# Altium project hotfire_teststand.PrjPcb
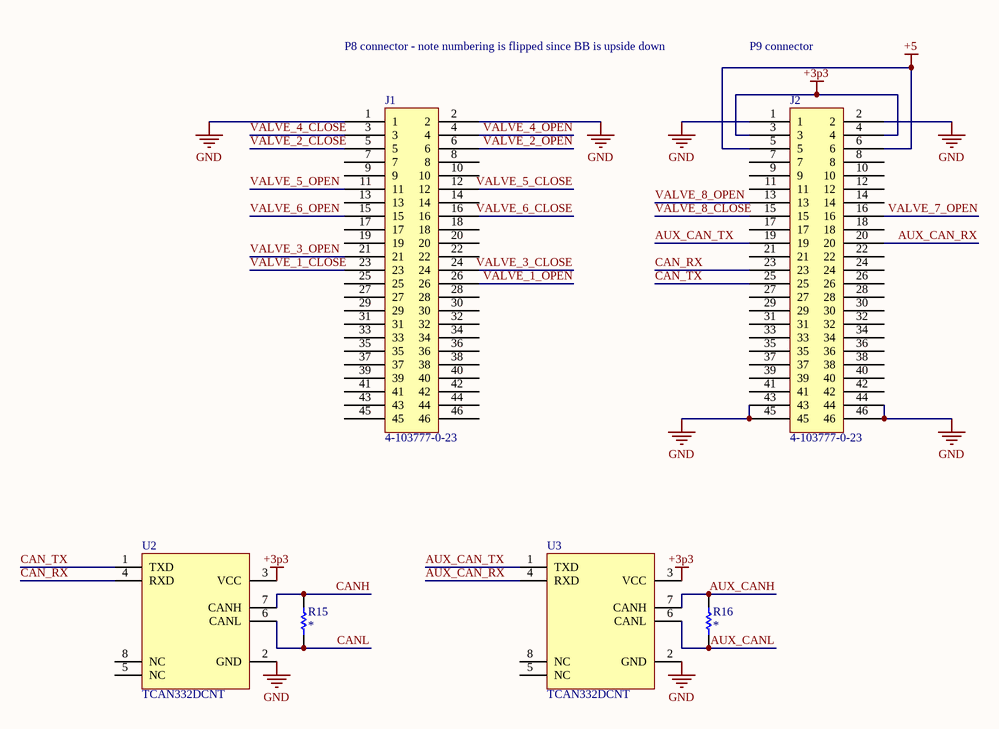
[diagram p0: beaglebone.SchDoc]
5 sheets, 80 parts. Net scope: hierarchical (ports join the sheet entries above them; power ports are global).
Sheets:
  beaglebone.SchDoc
  power.SchDoc
  valveconn.SchDoc
    DRV1 = valve.SchDoc
    DRV2 = valve.SchDoc
    DRV3 = valve.SchDoc
  ignition.SchDoc

## Sheet beaglebone.SchDoc: Monolith Beaglebone Connectors
size A; SheetNumber: 1; SheetTotal: 5

### Parts
J1  4-103777-0-23
J2  4-103777-0-23
R15  *  [R0603]
R16  *  [R0603]
U2  TCAN332DCNT  [SOT-23-8]
U3  TCAN332DCNT  [SOT-23-8]

### Nets
+3p3: J2.3 J2.4 U2.3(VCC) U3.3(VCC)
+5: J2.5 J2.6
GND: J1.1 J1.2 J2.1 J2.2 J2.43 J2.44 J2.45 J2.46 U2.2(GND) U3.2(GND)
AUX_CAN_RX: J2.20 U3.4(RXD)
AUX_CAN_TX: J2.19 U3.1(TXD)
AUX_CANH: R16.1 U3.7(CANH)
AUX_CANL: R16.2 U3.6(CANL)
CAN_RX: J2.23 U2.4(RXD)
CAN_TX: J2.25 U2.1(TXD)
CANH: R15.1 U2.7(CANH)
CANL: R15.2 U2.6(CANL)
VALVE_1_CLOSE: J1.23
VALVE_1_OPEN: J1.26
VALVE_2_CLOSE: J1.5
VALVE_2_OPEN: J1.6
VALVE_3_CLOSE: J1.24
VALVE_3_OPEN: J1.21
VALVE_4_CLOSE: J1.3
VALVE_4_OPEN: J1.4
VALVE_5_CLOSE: J1.12
VALVE_5_OPEN: J1.11
VALVE_6_CLOSE: J1.16
VALVE_6_OPEN: J1.15
VALVE_7_OPEN: J2.16
VALVE_8_CLOSE: J2.15
VALVE_8_OPEN: J2.13

Not connected (* = marked no-connect by the designer): J1 7 8 9 10 13 14 17 18 19 20 22 25 27 28 29 30 31 32 33 34 35 36 37 38 39 40 41 42 43 44 45 46; J2 7 8 9 10 11 12 14 17 18 21 22 24 26 27 28 29 30 31 32 33 34 35 36 37 38 39 40 41 42; U2 5(NC) 8(NC); U3 5(NC) 8(NC)

### Notes on the sheet
- P8 connector - note numbering is flipped since BB is upside down
- P9 connector

### Library data of the parts
R15 R16 = R0603: RESISTOR 0603; Value: *
U2 U3 = TCAN332DCNT: IC TXRX CAN 3.3V SOT23-8

## Sheet power.SchDoc: Monolith Power
size A; SheetNumber: 2; SheetTotal: 5
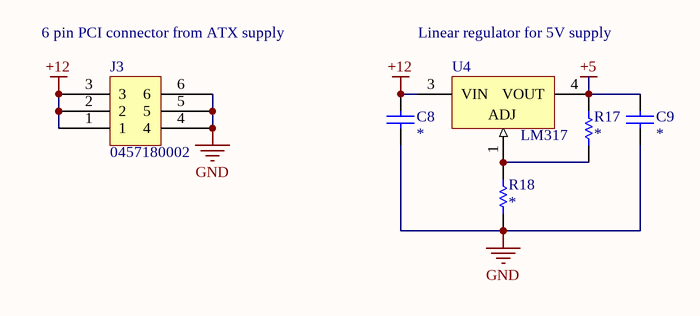
[diagram p1: power.SchDoc]

### Parts
C8  *  [C0603]
C9  *  [C0805]
J3  0457180002
R17  *  [R0603]
R18  *  [R0603]
U4  LM317  [D-PAK]

### Nets
+5: C9.1 R17.1 U4.4(VOUT)
+12: C8.1 J3.1 J3.2 J3.3 U4.3(VIN)
GND: C8.2 C9.2 J3.4 J3.5 J3.6 R18.2
NetR17_2: R17.2 R18.1 U4.1(ADJ)

### Notes on the sheet
- (near J3) 6 pin PCI connector from ATX supply
- Linear regulator for 5V supply

### Library data of the parts
C8 = C0603: 0603 Capacitor; Value: *
C9 = C0805: 0805 Capacitor; Value: *
R17 R18 = R0603: RESISTOR 0603; Value: *
U4 = LM317: Linear Voltage Regulator

## Sheet valveconn.SchDoc
size A; SheetNumber: 3; SheetTotal: 5
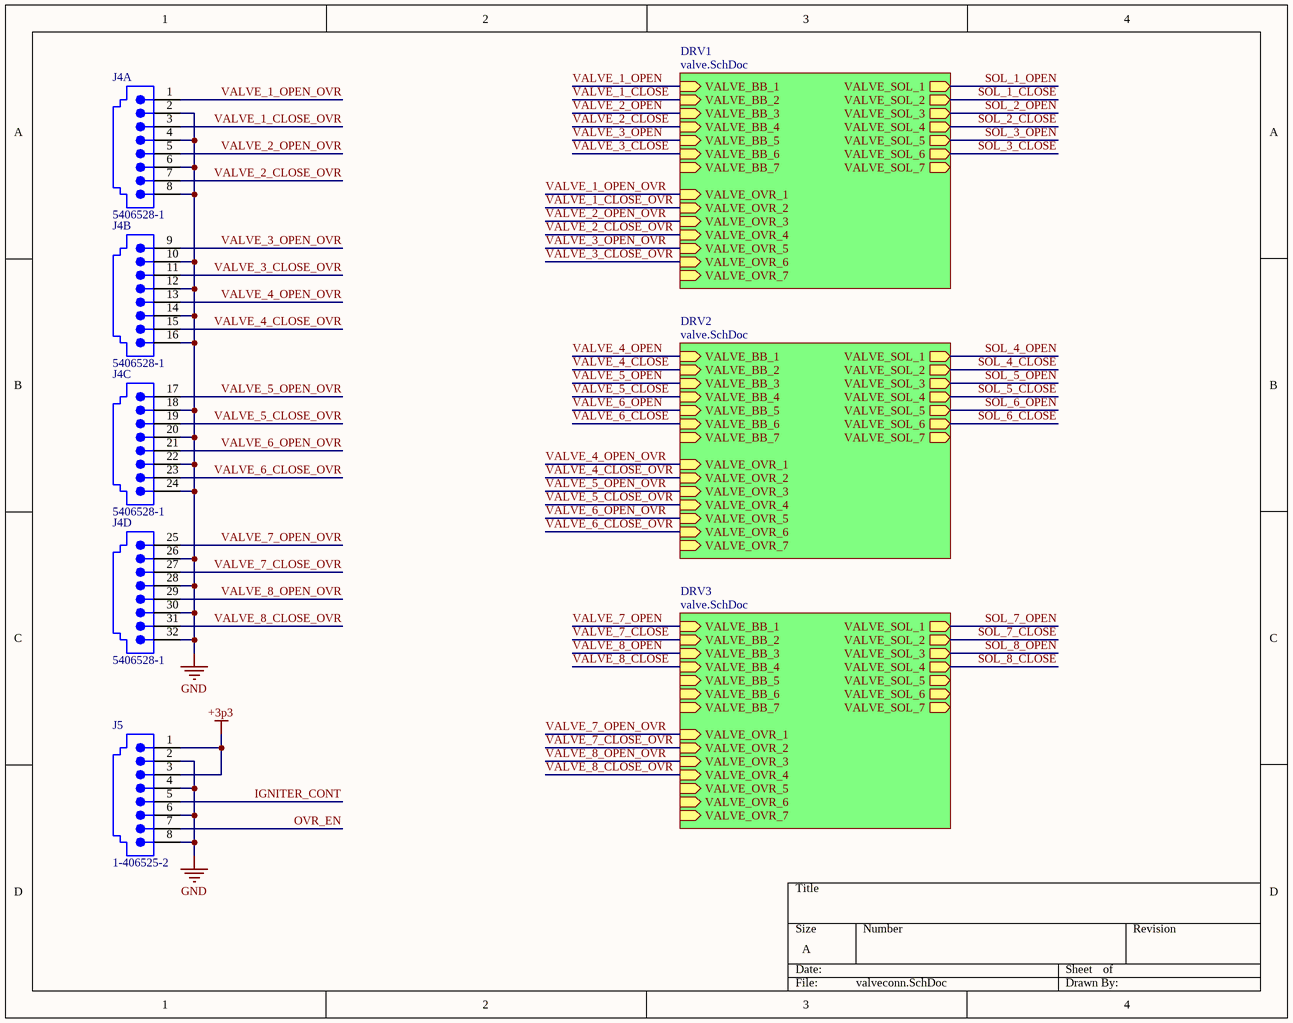
[diagram p2: valveconn.SchDoc]

### Parts
J4  5406528-1  [5406528-1]  (parts A,B,C,D of 4)
J5  1-406525-2  [1-406525-2]

### Sub-sheets
DRV1 = valve.SchDoc: VALVE_BB_7 (in), VALVE_OVR_4 (in), VALVE_BB_1 (in), VALVE_OVR_7 (in), VALVE_SOL_2 (out), VALVE_SOL_7 (out), VALVE_SOL_3 (out), VALVE_OVR_1 (in), VALVE_SOL_1 (out), VALVE_OVR_6 (in), VALVE_SOL_5 (out), VALVE_BB_2 (in), VALVE_BB_3 (in), VALVE_OVR_3 (in), VALVE_BB_4 (in), VALVE_OVR_5 (in), VALVE_SOL_4 (out), VALVE_BB_5 (in), VALVE_BB_6 (in), VALVE_SOL_6 (out), VALVE_OVR_2 (in)
DRV2 = valve.SchDoc: VALVE_BB_7 (in), VALVE_OVR_4 (in), VALVE_BB_1 (in), VALVE_OVR_7 (in), VALVE_SOL_2 (out), VALVE_SOL_7 (out), VALVE_SOL_3 (out), VALVE_OVR_1 (in), VALVE_SOL_1 (out), VALVE_OVR_6 (in), VALVE_SOL_5 (out), VALVE_BB_2 (in), VALVE_BB_3 (in), VALVE_OVR_3 (in), VALVE_BB_4 (in), VALVE_OVR_5 (in), VALVE_SOL_4 (out), VALVE_BB_5 (in), VALVE_BB_6 (in), VALVE_SOL_6 (out), VALVE_OVR_2 (in)
DRV3 = valve.SchDoc: VALVE_BB_7 (in), VALVE_OVR_4 (in), VALVE_BB_1 (in), VALVE_OVR_7 (in), VALVE_SOL_2 (out), VALVE_SOL_7 (out), VALVE_SOL_3 (out), VALVE_OVR_1 (in), VALVE_SOL_1 (out), VALVE_OVR_6 (in), VALVE_SOL_5 (out), VALVE_BB_2 (in), VALVE_BB_3 (in), VALVE_OVR_3 (in), VALVE_BB_4 (in), VALVE_OVR_5 (in), VALVE_SOL_4 (out), VALVE_BB_5 (in), VALVE_BB_6 (in), VALVE_SOL_6 (out), VALVE_OVR_2 (in)

### Nets
+3p3: J5.1 J5.3
GND: J4.2 J4.4 J4.6 J4.8 J4.10 J4.12 J4.14 J4.16 J4.18 J4.20 J4.22 J4.24 J4.26 J4.28 J4.30 J4.32 J5.2 J5.4 J5.6 J5.8
IGNITER_CONT: J5.5
OVR_EN: J5.7
VALVE_1_CLOSE_OVR: J4.3 ; sheet DRV1/VALVE_OVR_2
VALVE_1_OPEN_OVR: J4.1 ; sheet DRV1/VALVE_OVR_1
VALVE_2_CLOSE_OVR: J4.7 ; sheet DRV1/VALVE_OVR_4
VALVE_2_OPEN_OVR: J4.5 ; sheet DRV1/VALVE_OVR_3
VALVE_3_CLOSE_OVR: J4.11 ; sheet DRV1/VALVE_OVR_6
VALVE_3_OPEN_OVR: J4.9 ; sheet DRV1/VALVE_OVR_5
VALVE_4_CLOSE_OVR: J4.15 ; sheet DRV2/VALVE_OVR_2
VALVE_4_OPEN_OVR: J4.13 ; sheet DRV2/VALVE_OVR_1
VALVE_5_CLOSE_OVR: J4.19 ; sheet DRV2/VALVE_OVR_4
VALVE_5_OPEN_OVR: J4.17 ; sheet DRV2/VALVE_OVR_3
VALVE_6_CLOSE_OVR: J4.23 ; sheet DRV2/VALVE_OVR_6
VALVE_6_OPEN_OVR: J4.21 ; sheet DRV2/VALVE_OVR_5
VALVE_7_CLOSE_OVR: J4.27 ; sheet DRV3/VALVE_OVR_2
VALVE_7_OPEN_OVR: J4.25 ; sheet DRV3/VALVE_OVR_1
VALVE_8_CLOSE_OVR: J4.31 ; sheet DRV3/VALVE_OVR_4
VALVE_8_OPEN_OVR: J4.29 ; sheet DRV3/VALVE_OVR_3

### Library data of the parts
J4 = 5406528-1: 4 port RJ45
J5 = 1-406525-2: 1 port RJ45

## Sheet valve.SchDoc: Monolith Valve Drivers
size A; SheetNumber: 4; SheetTotal: 5; R_OVR: 10k
Used 3 times, as channels DRV1, DRV2, DRV3. Parts and nets are listed once, with the designators drawn on the sheet.
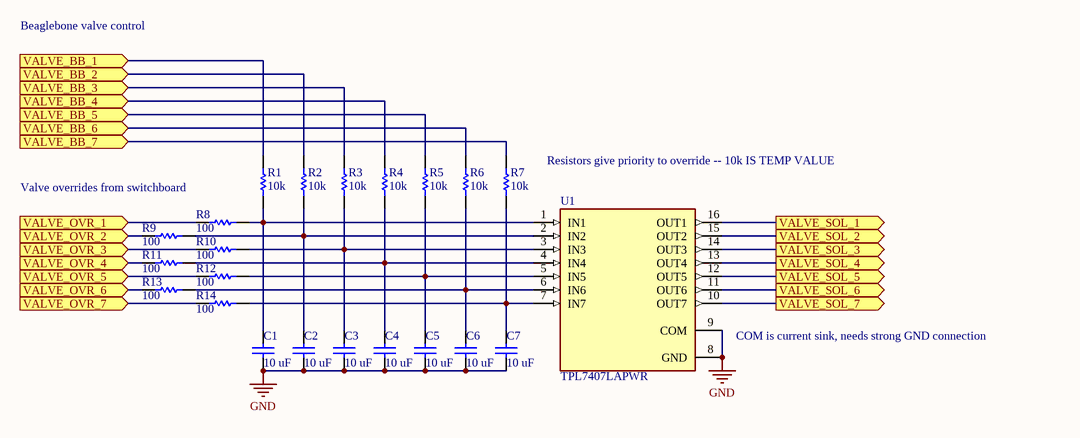
[diagram p3: valve.SchDoc]

### Parts
C1  10 uF  [C0805]
C2  10 uF  [C0805]
C3  10 uF  [C0805]
C4  10 uF  [C0805]
C5  10 uF  [C0805]
C6  10 uF  [C0805]
C7  10 uF  [C0805]
R1  10k  [R0603]
R2  10k  [R0603]
R3  10k  [R0603]
R4  10k  [R0603]
R5  10k  [R0603]
R6  10k  [R0603]
R7  10k  [R0603]
R8  100  [R0603]
R9  100  [R0603]
R10  100  [R0603]
R11  100  [R0603]
R12  100  [R0603]
R13  100  [R0603]
R14  100  [R0603]
U1  TPL7407LAPWR  [FP-PW0016A-IPC_A]

### Ports
VALVE_BB_1 (in), VALVE_BB_2 (in), VALVE_BB_3 (in), VALVE_BB_4 (in), VALVE_BB_5 (in), VALVE_BB_6 (in), VALVE_BB_7 (in), VALVE_OVR_1 (in), VALVE_OVR_2 (in), VALVE_OVR_3 (in), VALVE_OVR_4 (in), VALVE_OVR_5 (in), VALVE_OVR_6 (in), VALVE_OVR_7 (in), VALVE_SOL_1 (out), VALVE_SOL_2 (out), VALVE_SOL_3 (out), VALVE_SOL_4 (out), VALVE_SOL_5 (out), VALVE_SOL_6 (out), VALVE_SOL_7 (out)

### Nets
GND: C1.2 C2.2 C3.2 C4.2 C5.2 C6.2 C7.2 U1.8(GND) U1.9(COM)
VALVE_BB_1: R1.1 ; port VALVE_BB_1
VALVE_BB_2: R2.1 ; port VALVE_BB_2
VALVE_BB_3: R3.1 ; port VALVE_BB_3
VALVE_BB_4: R4.1 ; port VALVE_BB_4
VALVE_BB_5: R5.1 ; port VALVE_BB_5
VALVE_BB_6: R6.1 ; port VALVE_BB_6
VALVE_BB_7: R7.1 ; port VALVE_BB_7
VALVE_OVR_1: R8.2 ; port VALVE_OVR_1
VALVE_OVR_2: R9.2 ; port VALVE_OVR_2
VALVE_OVR_3: R10.2 ; port VALVE_OVR_3
VALVE_OVR_4: R11.2 ; port VALVE_OVR_4
VALVE_OVR_5: R12.2 ; port VALVE_OVR_5
VALVE_OVR_6: R13.2 ; port VALVE_OVR_6
VALVE_OVR_7: R14.2 ; port VALVE_OVR_7
VALVE_SOL_1: U1.16(OUT1) ; port VALVE_SOL_1
VALVE_SOL_2: U1.15(OUT2) ; port VALVE_SOL_2
VALVE_SOL_3: U1.14(OUT3) ; port VALVE_SOL_3
VALVE_SOL_4: U1.13(OUT4) ; port VALVE_SOL_4
VALVE_SOL_5: U1.12(OUT5) ; port VALVE_SOL_5
VALVE_SOL_6: U1.11(OUT6) ; port VALVE_SOL_6
VALVE_SOL_7: U1.10(OUT7) ; port VALVE_SOL_7
NetC1_1: C1.1 R1.2 R8.1 U1.1(IN1)
NetC2_1: C2.1 R2.2 R9.1 U1.2(IN2)
NetC3_1: C3.1 R3.2 R10.1 U1.3(IN3)
NetC4_1: C4.1 R4.2 R11.1 U1.4(IN4)
NetC5_1: C5.1 R5.2 R12.1 U1.5(IN5)
NetC6_1: C6.1 R6.2 R13.1 U1.6(IN6)
NetC7_1: C7.1 R7.2 R14.1 U1.7(IN7)

### Channels
DRV1: designators end in _DRV1; ports VALVE_BB_1=VALVE_1_OPEN VALVE_BB_2=VALVE_1_CLOSE VALVE_BB_3=VALVE_2_OPEN VALVE_BB_4=VALVE_2_CLOSE VALVE_BB_5=VALVE_3_OPEN VALVE_BB_6=VALVE_3_CLOSE VALVE_BB_7=NetR7_DRV1_1 VALVE_OVR_1=VALVE_1_OPEN_OVR VALVE_OVR_2=VALVE_1_CLOSE_OVR VALVE_OVR_3=VALVE_2_OPEN_OVR VALVE_OVR_4=VALVE_2_CLOSE_OVR VALVE_OVR_5=VALVE_3_OPEN_OVR VALVE_OVR_6=VALVE_3_CLOSE_OVR VALVE_OVR_7=NetR14_DRV1_2 VALVE_SOL_1=SOL_1_OPEN VALVE_SOL_2=SOL_1_CLOSE VALVE_SOL_3=SOL_2_OPEN VALVE_SOL_4=SOL_2_CLOSE VALVE_SOL_5=SOL_3_OPEN VALVE_SOL_6=SOL_3_CLOSE VALVE_SOL_7=NetU1_DRV1_10
DRV2: designators end in _DRV2; ports VALVE_BB_1=VALVE_4_OPEN VALVE_BB_2=VALVE_4_CLOSE VALVE_BB_3=VALVE_5_OPEN VALVE_BB_4=VALVE_5_CLOSE VALVE_BB_5=VALVE_6_OPEN VALVE_BB_6=VALVE_6_CLOSE VALVE_BB_7=NetR7_DRV2_1 VALVE_OVR_1=VALVE_4_OPEN_OVR VALVE_OVR_2=VALVE_4_CLOSE_OVR VALVE_OVR_3=VALVE_5_OPEN_OVR VALVE_OVR_4=VALVE_5_CLOSE_OVR VALVE_OVR_5=VALVE_6_OPEN_OVR VALVE_OVR_6=VALVE_6_CLOSE_OVR VALVE_OVR_7=NetR14_DRV2_2 VALVE_SOL_1=SOL_4_OPEN VALVE_SOL_2=SOL_4_CLOSE VALVE_SOL_3=SOL_5_OPEN VALVE_SOL_4=SOL_5_CLOSE VALVE_SOL_5=SOL_6_OPEN VALVE_SOL_6=SOL_6_CLOSE VALVE_SOL_7=NetU1_DRV2_10
DRV3: designators end in _DRV3; ports VALVE_BB_1=VALVE_7_OPEN VALVE_BB_2=VALVE_7_CLOSE VALVE_BB_3=VALVE_8_OPEN VALVE_BB_4=VALVE_8_CLOSE VALVE_BB_5=NetR5_DRV3_1 VALVE_BB_6=NetR6_DRV3_1 VALVE_BB_7=NetR7_DRV3_1 VALVE_OVR_1=VALVE_7_OPEN_OVR VALVE_OVR_2=VALVE_7_CLOSE_OVR VALVE_OVR_3=VALVE_8_OPEN_OVR VALVE_OVR_4=VALVE_8_CLOSE_OVR VALVE_OVR_5=NetR12_DRV3_2 VALVE_OVR_6=NetR13_DRV3_2 VALVE_OVR_7=NetR14_DRV3_2 VALVE_SOL_1=SOL_7_OPEN VALVE_SOL_2=SOL_7_CLOSE VALVE_SOL_3=SOL_8_OPEN VALVE_SOL_4=SOL_8_CLOSE VALVE_SOL_5=NetU1_DRV3_12 VALVE_SOL_6=NetU1_DRV3_11 VALVE_SOL_7=NetU1_DRV3_10

### Notes on the sheet
- Beaglebone valve control
- Valve overrides from switchboard
- Resistors give priority to override -- 10k IS TEMP VALUE
- (near U1) COM is current sink, needs strong GND connection

### Library data of the parts
C1-C7 = C0805: 0805 Capacitor; Value: 10 uF
R1-R14 = R0603: RESISTOR 0603
  R1-R7: Value: 10k
  R8-R14: Value: 100
U1 = CMP-04910-000066-1: IC PWR DRIVER N-CHAN 1:1 16TSSOP; Interface: Parallel; Output Configuration: Low Side; Number of Outputs: 7; Max Output Current: 500mA; Case/Package: TSSOP; Packaging: Cut Tape; RoHS Compliant: Yes; Max Operating Temperature: 125°C; Min Operating Temperature: -40°C; Number of Drivers: 7; Number of Pins: 16

## Sheet ignition.SchDoc
size A; SheetNumber: 5; SheetTotal: 5

## Nets that join several sheets
+3p3: beaglebone (J2.3 J2.4 U2.3 U3.3), valveconn (J5.1 J5.3)
+5: beaglebone (J2.5 J2.6), power (C9.1 R17.1 U4.4)
GND: beaglebone (10 pins), power (6 pins), valveconn (20 pins), DRV1 (9 pins), DRV2 (9 pins), DRV3 (9 pins)
VALVE_1_CLOSE_OVR: valveconn (J4.3), DRV1 (R9_DRV1.2)
VALVE_1_OPEN_OVR: valveconn (J4.1), DRV1 (R8_DRV1.2)
VALVE_2_CLOSE_OVR: valveconn (J4.7), DRV1 (R11_DRV1.2)
VALVE_2_OPEN_OVR: valveconn (J4.5), DRV1 (R10_DRV1.2)
VALVE_3_CLOSE_OVR: valveconn (J4.11), DRV1 (R13_DRV1.2)
VALVE_3_OPEN_OVR: valveconn (J4.9), DRV1 (R12_DRV1.2)
VALVE_4_CLOSE_OVR: valveconn (J4.15), DRV2 (R9_DRV2.2)
VALVE_4_OPEN_OVR: valveconn (J4.13), DRV2 (R8_DRV2.2)
VALVE_5_CLOSE_OVR: valveconn (J4.19), DRV2 (R11_DRV2.2)
VALVE_5_OPEN_OVR: valveconn (J4.17), DRV2 (R10_DRV2.2)
VALVE_6_CLOSE_OVR: valveconn (J4.23), DRV2 (R13_DRV2.2)
VALVE_6_OPEN_OVR: valveconn (J4.21), DRV2 (R12_DRV2.2)
VALVE_7_CLOSE_OVR: valveconn (J4.27), DRV3 (R9_DRV3.2)
VALVE_7_OPEN_OVR: valveconn (J4.25), DRV3 (R8_DRV3.2)
VALVE_8_CLOSE_OVR: valveconn (J4.31), DRV3 (R11_DRV3.2)
VALVE_8_OPEN_OVR: valveconn (J4.29), DRV3 (R10_DRV3.2)